# EAGLE schematic SnakeGame (EAGLE 7.4.0)
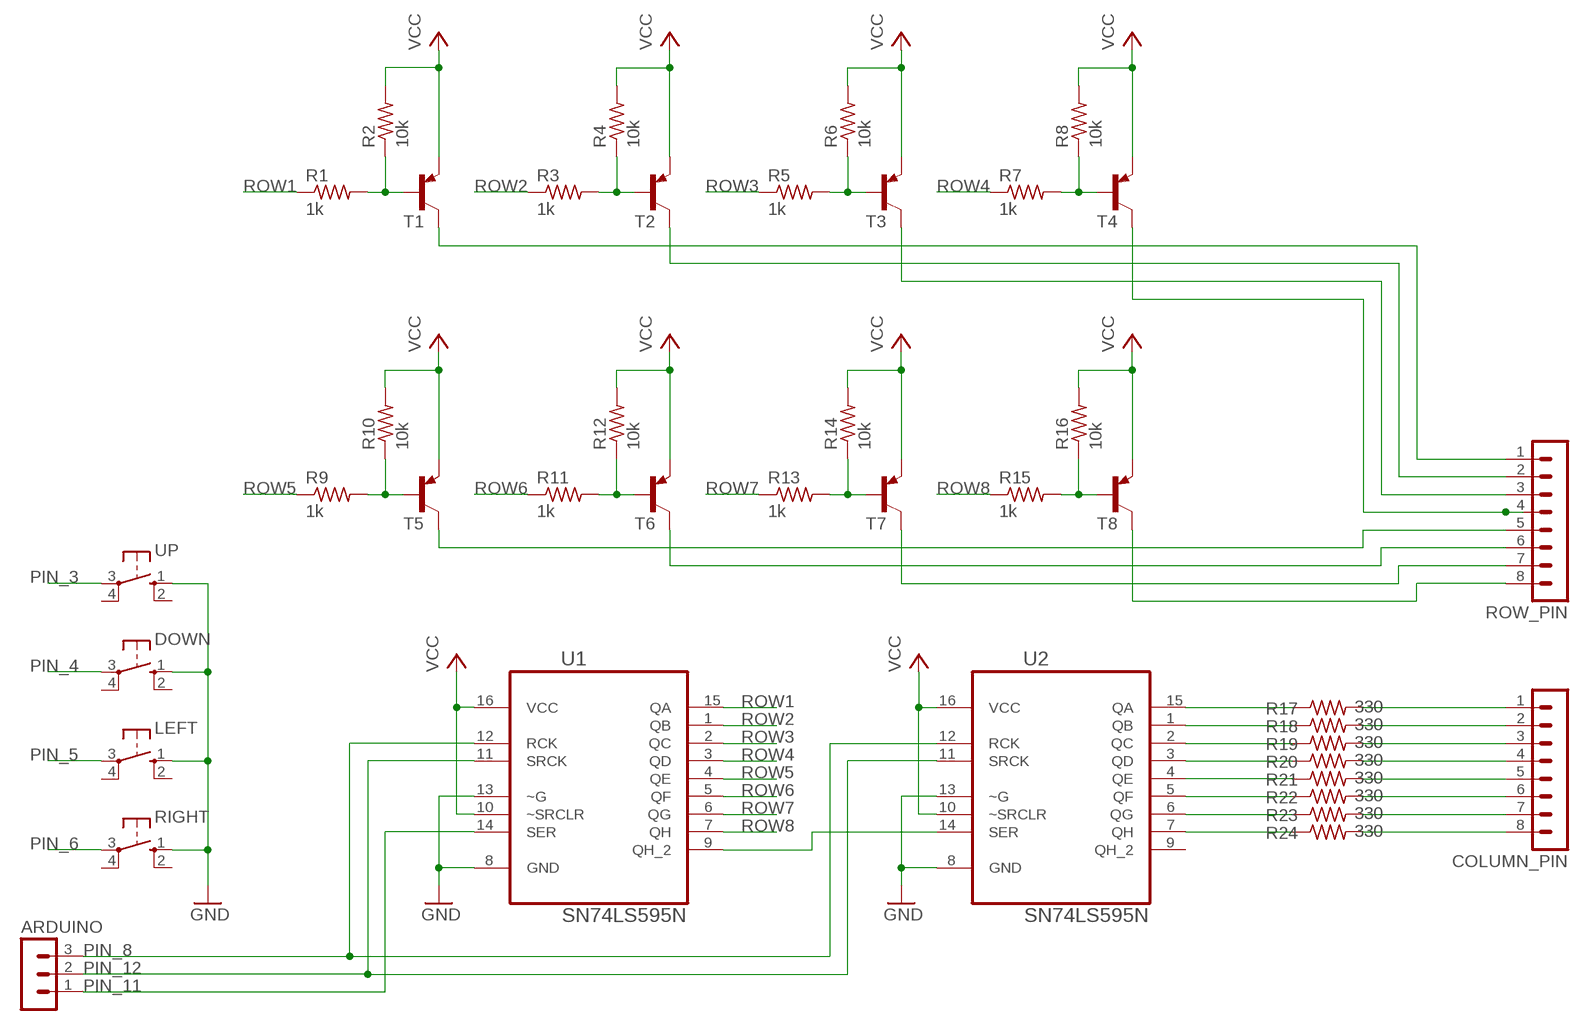
[diagram p0: schematic, sheet 1]

## Parts
ARDUINO  MA03-1  [MA03-1]
COLUMN_PIN  MA08-1  [MA08-1]
DOWN  10-XX  [B3F-10XX]
LEFT  10-XX  [B3F-10XX]
R1  1k  R-US_0204/7  [0204/7]
R2  10k  R-US_0204/7  [0204/7]
R3  1k  R-US_0204/7  [0204/7]
R4  10k  R-US_0204/7  [0204/7]
R5  1k  R-US_0204/7  [0204/7]
R6  10k  R-US_0204/7  [0204/7]
R7  1k  R-US_0204/7  [0204/7]
R8  10k  R-US_0204/7  [0204/7]
R9  1k  R-US_0204/7  [0204/7]
R10  10k  R-US_0204/7  [0204/7]
R11  1k  R-US_0204/7  [0204/7]
R12  10k  R-US_0204/7  [0204/7]
R13  1k  R-US_0204/7  [0204/7]
R14  10k  R-US_0204/7  [0204/7]
R15  1k  R-US_0204/7  [0204/7]
R16  10k  R-US_0204/7  [0204/7]
R17  330  R-US_0204/7  [0204/7]
R18  330  R-US_0204/7  [0204/7]
R19  330  R-US_0204/7  [0204/7]
R20  330  R-US_0204/7  [0204/7]
R21  330  R-US_0204/7  [0204/7]
R22  330  R-US_0204/7  [0204/7]
R23  330  R-US_0204/7  [0204/7]
R24  330  R-US_0204/7  [0204/7]
RIGHT  10-XX  [B3F-10XX]
ROW_PIN  MA08-1  [MA08-1]
T1  -PNP-TO92  [TO92]
T2  -PNP-TO92  [TO92]
T3  -PNP-TO92  [TO92]
T4  -PNP-TO92  [TO92]
T5  -PNP-TO92  [TO92]
T6  -PNP-TO92  [TO92]
T7  -PNP-TO92  [TO92]
T8  -PNP-TO92  [TO92]
U1  SN74LS595N  [DIP254P762X508-16]
U2  SN74LS595N  [DIP254P762X508-16]
UP  10-XX  [B3F-10XX]

## Nets
GND: DOWN.1(S) LEFT.1(S) RIGHT.1(S) U1.8(GND) U1.13(~G) U2.8(GND) U2.13(~G) UP.1(S)
N$1: U1.9(QH_2) U2.14(SER)
N$2: R17.1 U2.15(QA)
N$4: R18.1 U2.1(QB)
N$5: R19.1 U2.2(QC)
N$8: R20.1 U2.3(QD)
N$9: R21.1 U2.4(QE)
N$10: R22.1 U2.5(QF)
N$11: R1.2 R2.1 T1.2(B)
N$13: ROW_PIN.1 T1.3(C)
N$14: R3.2 R4.1 T2.2(B)
N$16: ROW_PIN.2 T2.3(C)
N$17: R5.2 R6.1 T3.2(B)
N$19: ROW_PIN.3 T3.3(C)
N$20: R7.2 R8.1 T4.2(B)
N$23: R9.2 R10.1 T5.2(B)
N$25: ROW_PIN.5 T5.3(C)
N$26: R11.2 R12.1 T6.2(B)
N$28: ROW_PIN.6 T6.3(C)
N$29: R13.2 R14.1 T7.2(B)
N$31: ROW_PIN.7 T7.3(C)
N$32: R15.2 R16.1 T8.2(B)
N$34: ROW_PIN.8 T8.3(C)
N$35: R23.1 U2.6(QG)
N$36: R24.1 U2.7(QH)
N$37: COLUMN_PIN.1 R17.2
N$38: COLUMN_PIN.2 R18.2
N$39: COLUMN_PIN.3 R19.2
N$40: COLUMN_PIN.4 R20.2
N$41: COLUMN_PIN.5 R21.2
N$42: COLUMN_PIN.6 R22.2
N$43: COLUMN_PIN.7 R23.2
N$44: COLUMN_PIN.8 R24.2
N$58: ROW_PIN.4 T4.3(C)
PIN_3: UP.3(P)
PIN_4: DOWN.3(P)
PIN_5: LEFT.3(P)
PIN_6: RIGHT.3(P)
PIN_8: ARDUINO.3 U1.12(RCK) U2.12(RCK)
PIN_11: ARDUINO.1 U1.14(SER)
PIN_12: ARDUINO.2 U1.11(SRCK) U2.11(SRCK)
ROW1: R1.1 U1.15(QA)
ROW2: R3.1 U1.1(QB)
ROW3: R5.1 U1.2(QC)
ROW4: R7.1 U1.3(QD)
ROW5: R9.1 U1.4(QE)
ROW6: R11.1 U1.5(QF)
ROW7: R13.1 U1.6(QG)
ROW8: R15.1 U1.7(QH)
VCC: R2.2 R4.2 R6.2 R8.2 R10.2 R12.2 R14.2 R16.2 T1.1(E) T2.1(E) T3.1(E) T4.1(E) T5.1(E) T6.1(E) T7.1(E) T8.1(E) U1.10(~SRCLR) U1.16(VCC) U2.10(~SRCLR) U2.16(VCC)
Unconnected: DOWN.2(S1) DOWN.4(P1) LEFT.2(S1) LEFT.4(P1) RIGHT.2(S1) RIGHT.4(P1) U2.9(QH_2) UP.2(S1) UP.4(P1)

## Library data of the parts
ARDUINO = con-lstb:MA03-1: PIN HEADER; OC_FARNELL: unknown; OC_NEWARK: unknown
COLUMN_PIN ROW_PIN = con-lstb:MA08-1: PIN HEADER; OC_FARNELL: unknown; OC_NEWARK: unknown
DOWN LEFT RIGHT UP = switch-omron:10-XX: OMRON SWITCH; MPN: B3F-1000; OC_FARNELL: 176432; OC_NEWARK: 36M3542
R1-R16 = resistor:R-US_: RESISTOR, American symbol
R17-R24 = rcl:R-US_: RESISTOR, American symbol
T1-T8 = transistor:*-PNP-: PNP Transistror
U1 U2 = Texas Instruments_By_element14_Batch_1:SN74LS595N: 8 BIT SHIFT REGISTERS WITH OUTPUT LATCHES; MPN: SN74LS595N; OC_FARNELL: 1750249; OC_NEWARK: 67K1099; PACKAGE: PDIP-16; SUPPLIER: Texas Instruments